# Altium schematic sheet Power.SchDoc
size A; SheetNumber: 8; SheetTotal: 11
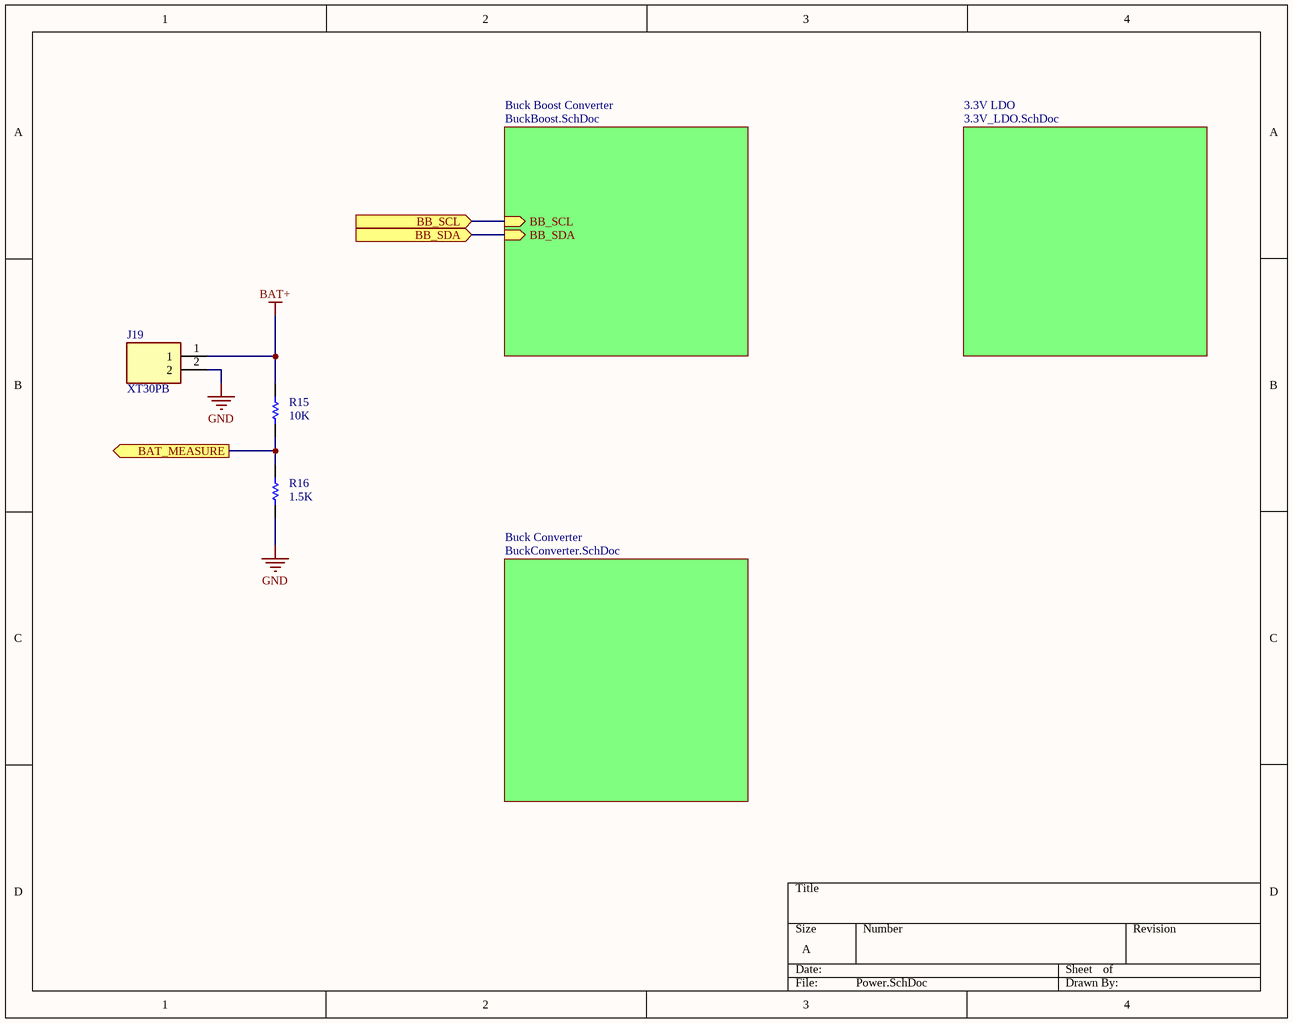
[diagram p0: Power.SchDoc]

## Parts
J19  XT30PB  [XT30PB]
R15  Resistance: 10K  [RESC1005X40X25LL05T10]  (hidden comment: RC0402FR-0710KL)
R16  Resistance: 1.5K  [RESC1005X40X25ML05T10]  (hidden comment: RC0402FR-071K5L)

## Sub-sheets
3.3V LDO = 3.3V_LDO.SchDoc: no entries
Buck Boost Converter = BuckBoost.SchDoc: BB_SCL (in), BB_SDA (in)
Buck Converter = BuckConverter.SchDoc: no entries

## Ports
BAT_MEASURE (out, see Main[3B], MicroController[1C]), BB_SCL (in), BB_SDA (in)

## Nets
BAT+: J19.1 R15.2
GND: J19.2 R16.1
BAT_MEASURE: R15.1 R16.2 ; port BAT_MEASURE
BB_SCL: port BB_SCL, sheet Buck Boost Converter/BB_SCL
BB_SDA: port BB_SDA, sheet Buck Boost Converter/BB_SDA

## Library data of the parts
J19 = XT30PB: Connector; Manufacturer_Name: Amass; Datasheet Link: https://www.tme.eu/Document/4acc913878197f8c2e30d4b8cdc47230/XT30UPB%20SPEC.pdf; Height: 10.7mm; Manufacturer_Part_Number: XT30PB
R15 = CMP-2002-07353-1: Manufacturer: Yageo / Phycomp; Part Number: RC0402FR-0710KL
R16 = CMP-2002-07464-1: Manufacturer: Yageo / Phycomp; Part Number: RC0402FR-071K5L